# EAGLE schematic Multimeter (EAGLE 9.6.2)

## Sheet 1 of 3: ADC
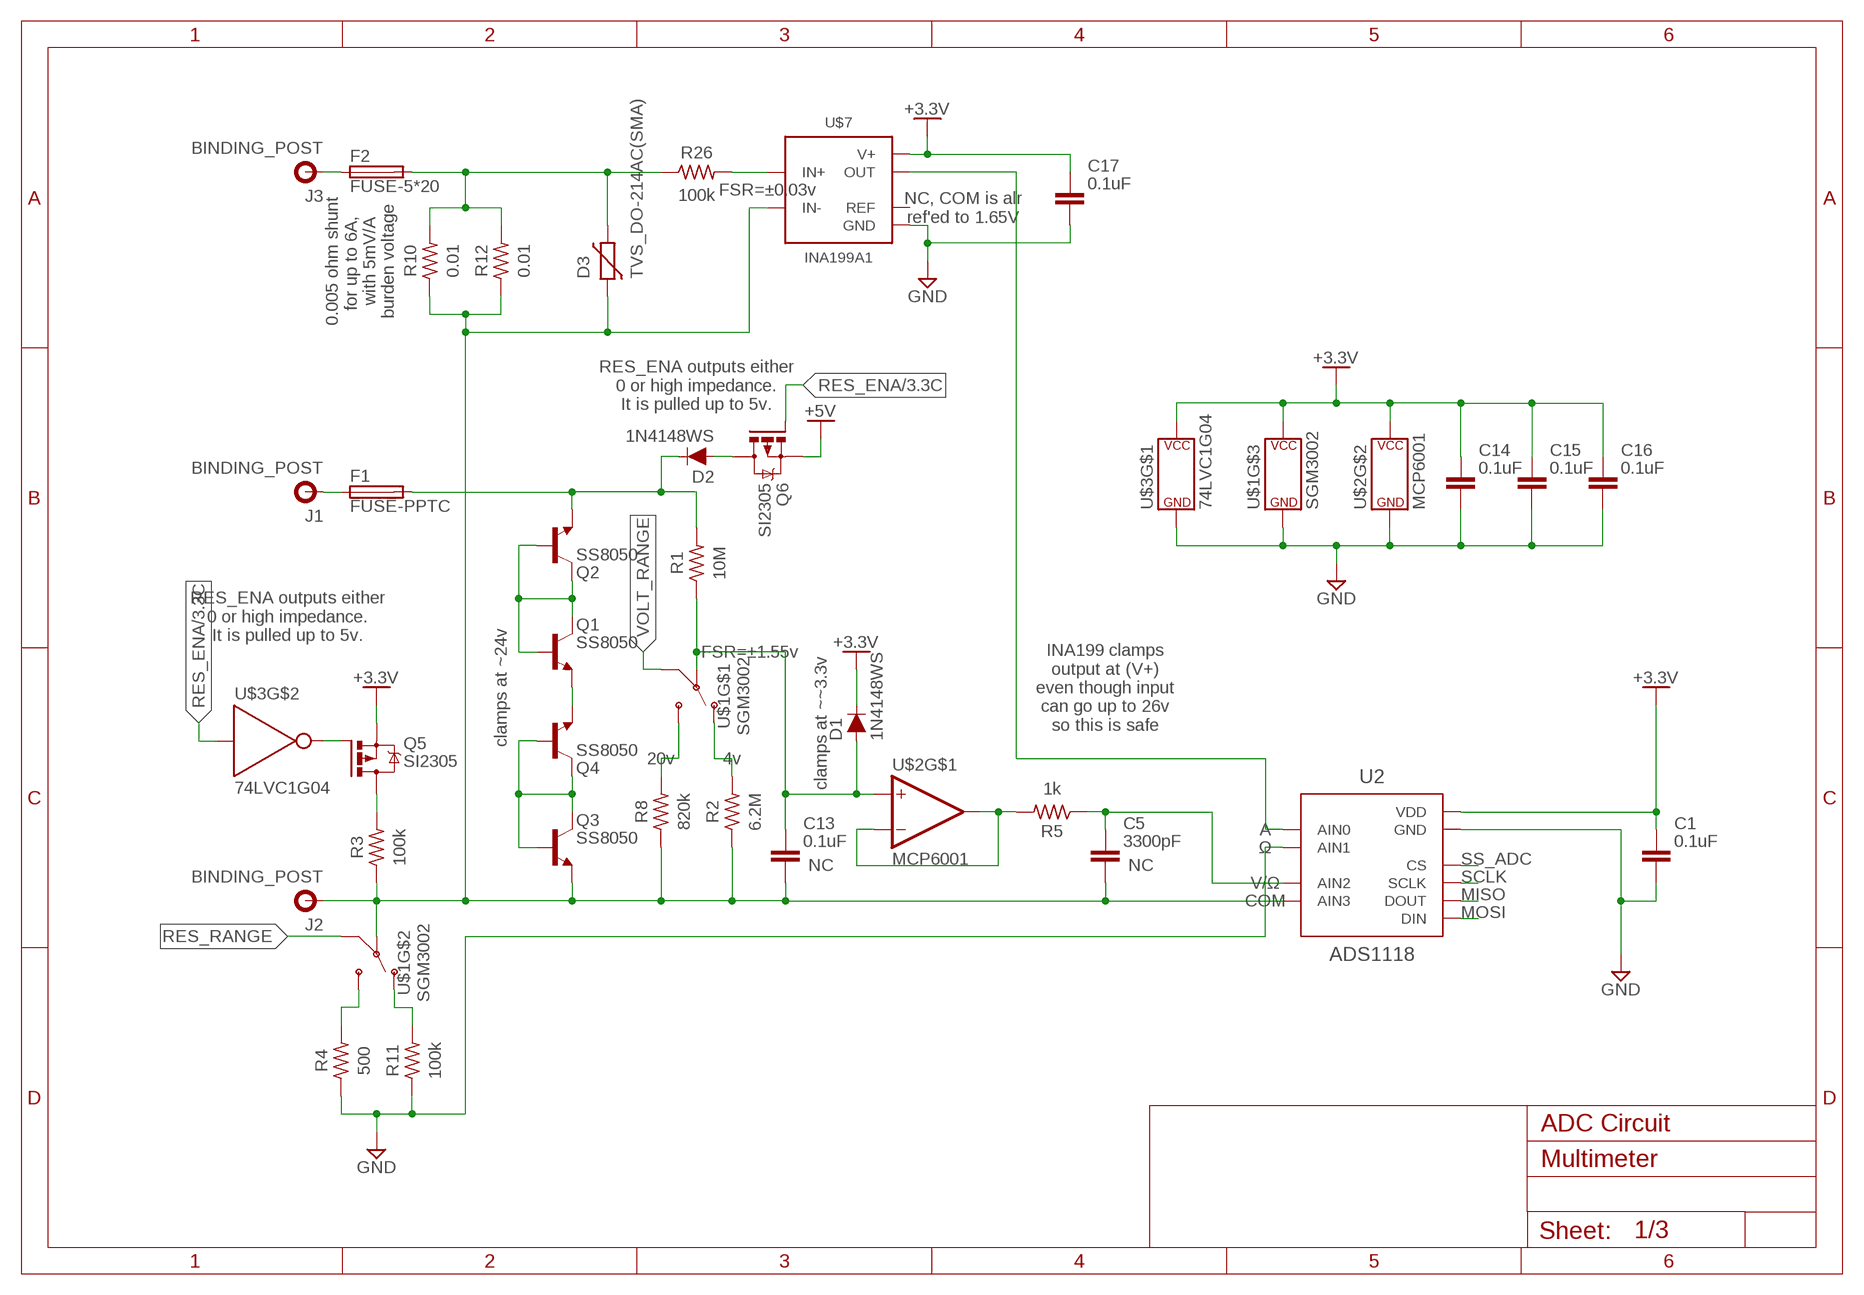
[diagram p0: schematic, sheet 1]

### Parts
C1  0.1uF  C_CHIP-0603(1608-METRIC)  [CAPC1608X85]
C5  3300pF  C_CHIP-0603(1608-METRIC)  [CAPC1608X85]
C13  0.1uF  C_CHIP-0603(1608-METRIC)  [CAPC1608X85]
C14  0.1uF  C_CHIP-0603(1608-METRIC)  [CAPC1608X85]
C15  0.1uF  C_CHIP-0603(1608-METRIC)  [CAPC1608X85]
C16  0.1uF  C_CHIP-0603(1608-METRIC)  [CAPC1608X85]
C17  0.1uF  C_CHIP-0603(1608-METRIC)  [CAPC1608X85]
D1  1N4148WS  DIODE  [SOD-323]
D2  1N4148WS  DIODE  [SOD-323]
D3  TVS_DO-214AC(SMA)  [DIOM5226X290N]
F1  FUSE-PPTC  [FUSE-PPTC-TH]
F2  FUSE-5*20  [FUSEHOLDER_"HD"]
J1  BINDING_POST  [BINDING_POST]
J2  BINDING_POST  [BINDING_POST]
J3  BINDING_POST  [BINDING_POST]
Q1  SS8050  NPN_SOT23  [SOT95P237X112-3N]
Q2  SS8050  NPN_SOT23  [SOT95P237X112-3N]
Q3  SS8050  NPN_SOT23  [SOT95P237X112-3N]
Q4  SS8050  NPN_SOT23  [SOT95P237X112-3N]
Q5  SI2305  PMOSFET_SOT23  [SOT23]
Q6  SI2305  PMOSFET_SOT23  [SOT23]
R1  10M  R-US_CHIP-0603(1608-METRIC)  [RESC1608X60]
R2  6.2M  R-US_CHIP-0603(1608-METRIC)  [RESC1608X60]
R3  100k  R-US_CHIP-0603(1608-METRIC)  [RESC1608X60]
R4  500  R-US_CHIP-0603(1608-METRIC)  [RESC1608X60]
R5  1k  R-US_CHIP-0603(1608-METRIC)  [RESC1608X60]
R8  820k  R-US_CHIP-0603(1608-METRIC)  [RESC1608X60]
R10  0.01  R-US_CHIP-2512(6332-METRIC)  [RESC6332X71]
R11  100k  R-US_CHIP-0603(1608-METRIC)  [RESC1608X60]
R12  0.01  R-US_CHIP-2512(6332-METRIC)  [RESC6332X71]
R26  100k  R-US_CHIP-0603(1608-METRIC)  [RESC1608X60]
U2  ADS1118  [VSSOP10]
U$1  SGM3002  [MSOP10]
U$2  MCP6001  [SOT23-5]
U$3  74LVC1G04  [SOT23-5]
U$7  INA199A1  INA199  [SC70-6]

### Nets
+3.3V: C1.1 C14.1 C15.1 C16.1 C17.1 D1.C Q5.2(S) U2.8(VDD) U$1.8(P$V+) U$2.5(P$V+) U$3.5(P$V+) U$7.3(V+) ; also sheet 2,3
+5V: Q6.2(S) ; also sheet 2,3
COM: C5.2 C13.2 D3.1 J2.P$1 Q3.1(E) R2.1 R3.1 R8.1 R10.1 R12.1 U2.7(AIN3) U$1.6(COM) U$7.5(IN-)
GND: C1.2 C14.2 C15.2 C16.2 C17.2 R4.1 R11.1 U2.3(GND) U2.5(AIN1) U$1.3(P$V-) U$2.2(P$V-) U$3.3(P$V-) U$7.2(GND) ; also sheet 2,3
MISO: U2.9(DOUT) ; also sheet 2
MOSI: U2.10(DIN) ; also sheet 2,3
N$1: D2.C F1.P$2 Q2.1(E) R1.2
N$3: C13.1 D1.A R1.1 U$1.10(COM) U$2.3(+IN)
N$4: D2.A Q6.3(D)
N$5: Q3.2(B) Q3.3(C) Q4.2(B) Q4.3(C)
N$6: F2.P$1 J3.P$1
N$8: R5.2 U$2.1(OUT) U$2.4(-IN)
N$11: C5.1 R5.1 U2.6(AIN2)
N$13: U2.4(AIN0) U$7.6(OUT)
N$14: R4.2 U$1.4(NO)
N$15: R8.2 U$1.2(NO)
N$16: R2.2 U$1.9(NC)
N$17: Q1.2(B) Q1.3(C) Q2.2(B) Q2.3(C)
N$18: Q1.1(E) Q4.1(E)
N$19: F1.P$1 J1.P$1
N$20: R11.2 U$1.7(NC)
N$21: D3.2 F2.P$2 R10.2 R12.2 R26.1
N$23: Q5.3(D) R3.2
N$25: Q5.1(G) U$3.4(Y)
N$38: R26.2 U$7.4(IN+)
RES_ENA: Q6.1(G) U$3.2(A) ; also sheet 2,3
RES_RANGE: U$1.5(IN) ; also sheet 2
SCLK: U2.1(SCLK) ; also sheet 2,3
SS_ADC: U2.2(CS) ; also sheet 2
VOLT_RANGE: U$1.1(IN) ; also sheet 2
Unconnected: U$7.1(REF)

### Notes on the sheet
- FSR=±0.03v
- NC, COM is alr
  ref'ed to 1.65V
- 0.005 ohm shunt
  for up to 6A, 
  with 5mV/A
  burden voltage
- RES_ENA outputs either
  0 or high impedance.
  It is pulled up to 5v.
- RES_ENA outputs either
  0 or high impedance.
  It is pulled up to 5v.
- FSR=±1.55v
- clamps at ~24v
- INA199 clamps
  output at (V+)
  even though input
  can go up to 26v
  so this is safe
- clamps at ~~3.3v
- 20v | 4v
- A
- Ω
- NC | NC
- V/Ω
- COM
- ADC Circuit

## Sheet 2 of 3: MCU & Power
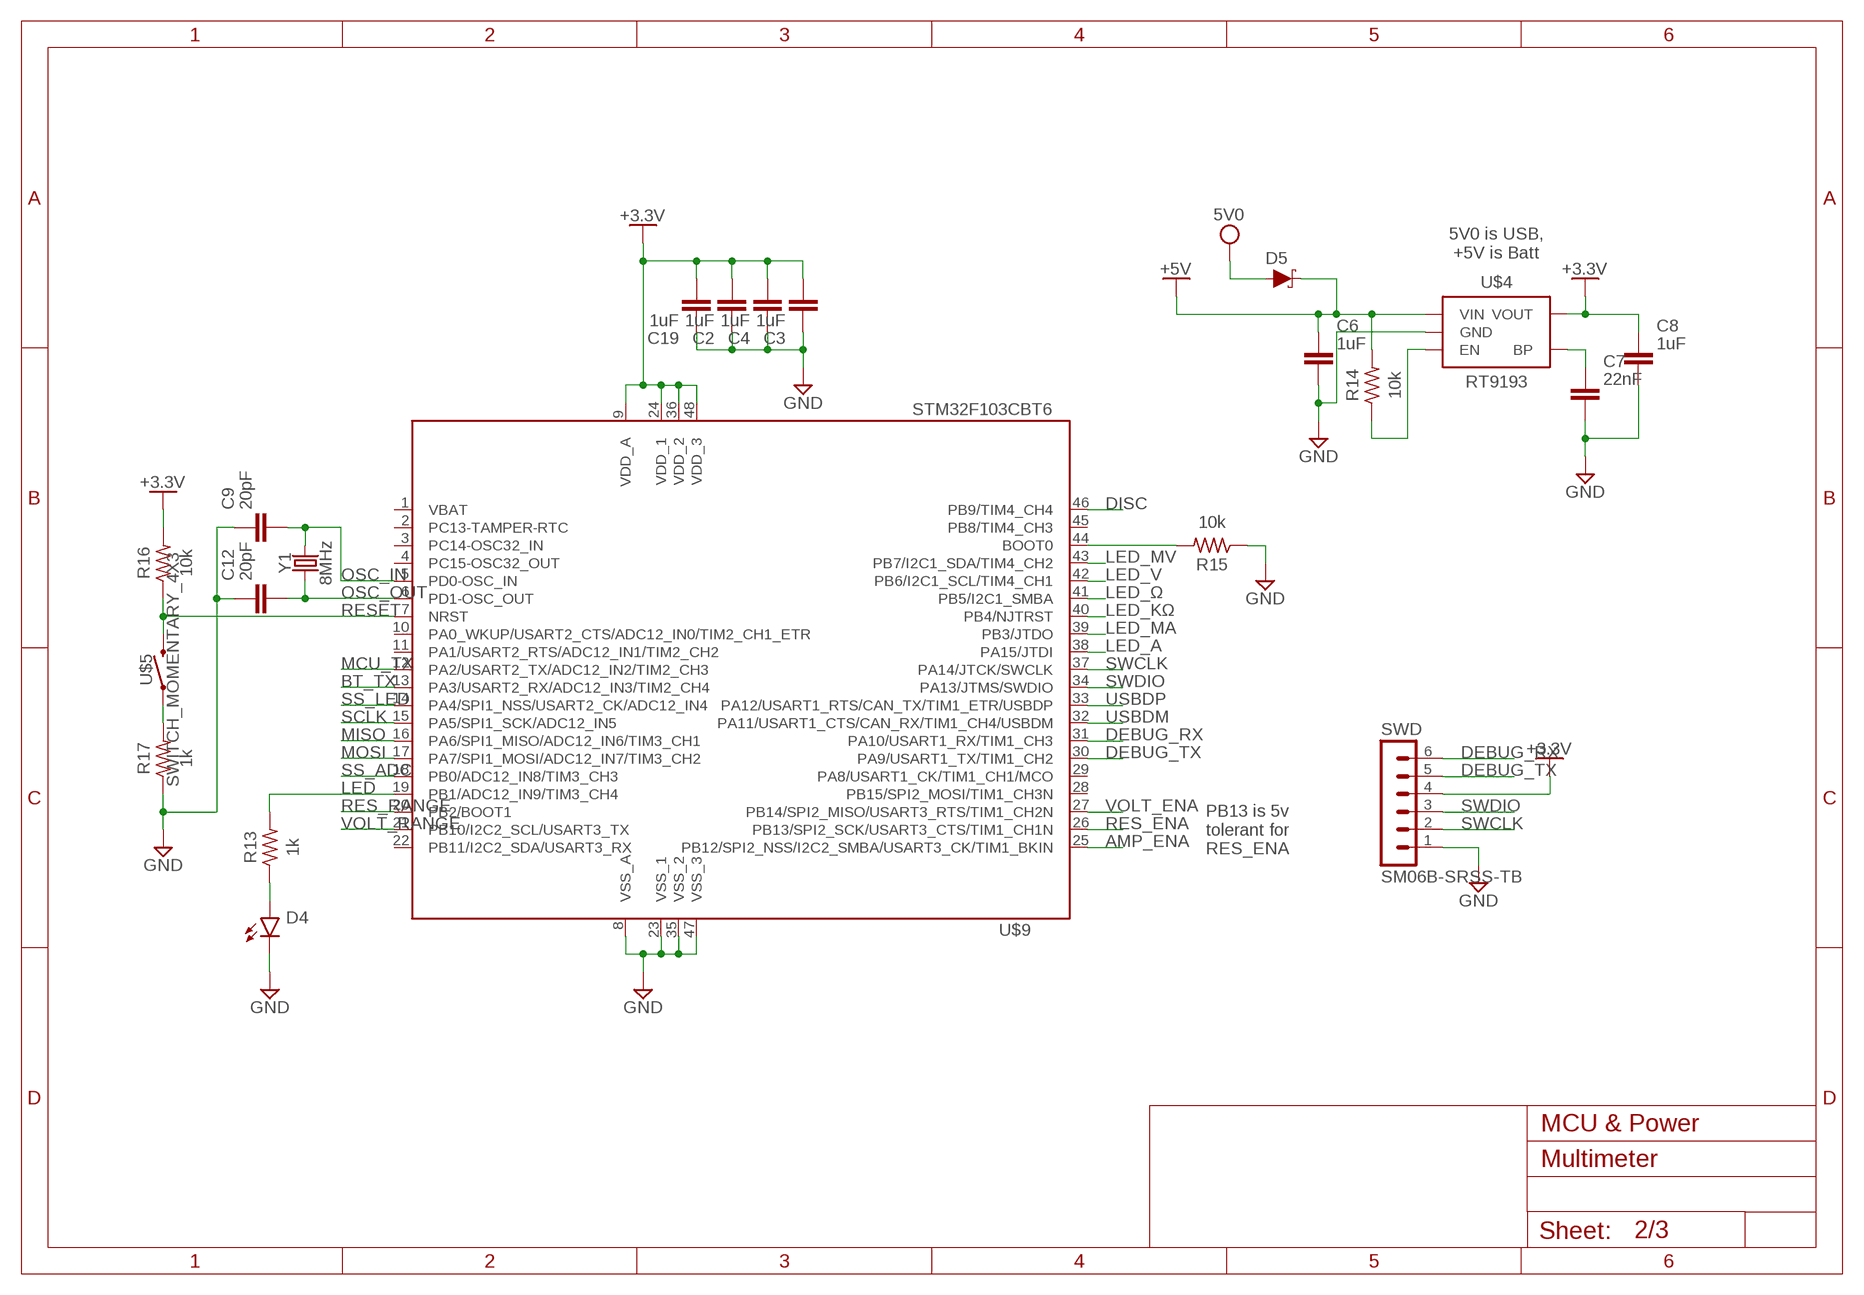
[diagram p1: schematic, sheet 2]

### Parts
C2  1uF  C_CHIP-0603(1608-METRIC)  [CAPC1608X85]
C3  1uF  C_CHIP-0603(1608-METRIC)  [CAPC1608X85]
C4  1uF  C_CHIP-0603(1608-METRIC)  [CAPC1608X85]
C6  1uF  C_CHIP-0603(1608-METRIC)  [CAPC1608X85]
C7  22nF  C_CHIP-0603(1608-METRIC)  [CAPC1608X85]
C8  1uF  C_CHIP-0603(1608-METRIC)  [CAPC1608X85]
C9  20pF  C_CHIP-0603(1608-METRIC)  [CAPC1608X85]
C12  20pF  C_CHIP-0603(1608-METRIC)  [CAPC1608X85]
C19  1uF  C_CHIP-0603(1608-METRIC)  [CAPC1608X85]
D4  LED_CHIP_BLUE-1608  [LEDC1608X39N_B]
D5  DIODE-SCHOTTKY  [SMA-DIODE]
R13  1k  R-US_CHIP-0603(1608-METRIC)  [RESC1608X60]
R14  10k  R-US_CHIP-0603(1608-METRIC)  [RESC1608X60]
R15  10k  R-US_CHIP-0603(1608-METRIC)  [RESC1608X60]
R16  10k  R-US_CHIP-0603(1608-METRIC)  [RESC1608X60]
R17  1k  R-US_CHIP-0603(1608-METRIC)  [RESC1608X60]
SWD  SM06B-SRSS-TB  [SM06B-SRSS-TB]
U$4  RT9193  [SOT23-5]
U$5  SWITCH_MOMENTARY_4X3  [MOMENTARY_SWITCH_4X3]
U$9  STM32F103CBT6  [LQFP48]
Y1  8MHz  CRYSTAL_5032  [CRYSTAL-SMD-5X3.2-2PAD]

### Nets
5V0: D5.A ; also sheet 3
+3.3V: C2.2 C3.2 C4.2 C8.1 C19.2 R16.2 SWD.4 U$4.5(VOUT) U$9.9(VDD_A) U$9.24(VDD_1) U$9.36(VDD_2) U$9.48(VDD_3) ; also sheet 1,3
+5V: C6.1 D5.C R14.2 U$4.1(VIN) ; also sheet 1,3
AMP_ENA: U$9.25(PB12/SPI2_NSS/I2C2_SMBA/USART3_CK/TIM1_BKIN) ; also sheet 3
BT_TX: U$9.13(PA3/USART2_RX/ADC12_IN3/TIM2_CH4) ; also sheet 3
DEBUG_RX: SWD.6 U$9.31(PA10/USART1_RX/TIM1_CH3)
DEBUG_TX: SWD.5 U$9.30(PA9/USART1_TX/TIM1_CH2)
DISC: U$9.46(PB9/TIM4_CH4) ; also sheet 3
GND: C2.1 C3.1 C4.1 C6.2 C7.2 C8.2 C9.1 C12.1 C19.1 D4.2(C) R15.1 R17.1 SWD.1 U$4.2(GND) U$9.8(VSS_A) U$9.23(VSS_1) U$9.35(VSS_2) U$9.47(VSS_3) ; also sheet 1,3
LED: R13.2 U$9.19(PB1/ADC12_IN9/TIM3_CH4)
LED_A: U$9.38(PA15/JTDI) ; also sheet 3
LED_KΩ: U$9.40(PB4/NJTRST) ; also sheet 3
LED_MA: U$9.39(PB3/JTDO) ; also sheet 3
LED_MV: U$9.43(PB7/I2C1_SDA/TIM4_CH2) ; also sheet 3
LED_V: U$9.42(PB6/I2C1_SCL/TIM4_CH1) ; also sheet 3
LED_Ω: U$9.41(PB5/I2C1_SMBA) ; also sheet 3
MCU_TX: U$9.12(PA2/USART2_TX/ADC12_IN2/TIM2_CH3) ; also sheet 3
MISO: U$9.16(PA6/SPI1_MISO/ADC12_IN6/TIM3_CH1) ; also sheet 1
MOSI: U$9.17(PA7/SPI1_MOSI/ADC12_IN7/TIM3_CH2) ; also sheet 1,3
N$7: D4.1(A) R13.1
N$9: R14.1 U$4.3(EN)
N$10: C7.1 U$4.4(BP)
N$12: R17.2 U$5.P$1
N$36: R15.2 U$9.44(BOOT0)
OSC_IN: C9.2 U$9.5(PD0-OSC_IN) Y1.P$2
OSC_OUT: C12.2 U$9.6(PD1-OSC_OUT) Y1.P$1
RES_ENA: U$9.26(PB13/SPI2_SCK/USART3_CTS/TIM1_CH1N) ; also sheet 1,3
RES_RANGE: U$9.20(PB2/BOOT1) ; also sheet 1
RESET: R16.1 U$5.P$2 U$9.7(NRST)
SCLK: U$9.15(PA5/SPI1_SCK/ADC12_IN5) ; also sheet 1,3
SS_ADC: U$9.18(PB0/ADC12_IN8/TIM3_CH3) ; also sheet 1
SS_LED: U$9.14(PA4/SPI1_NSS/USART2_CK/ADC12_IN4) ; also sheet 3
SWCLK: SWD.2 U$9.37(PA14/JTCK/SWCLK)
SWDIO: SWD.3 U$9.34(PA13/JTMS/SWDIO)
USBDM: U$9.32(PA11/USART1_CTS/CAN_RX/TIM1_CH4/USBDM) ; also sheet 3
USBDP: U$9.33(PA12/USART1_RTS/CAN_TX/TIM1_ETR/USBDP) ; also sheet 3
VOLT_ENA: U$9.27(PB14/SPI2_MISO/USART3_RTS/TIM1_CH2N) ; also sheet 3
VOLT_RANGE: U$9.21(PB10/I2C2_SCL/USART3_TX) ; also sheet 1
Unconnected: U$9.2(PC13-TAMPER-RTC) U$9.3(PC14-OSC32_IN) U$9.4(PC15-OSC32_OUT) U$9.10(PA0_WKUP/USART2_CTS/ADC12_IN0/TIM2_CH1_ETR) U$9.11(PA1/USART2_RTS/ADC12_IN1/TIM2_CH2) U$9.22(PB11/I2C2_SDA/USART3_RX) U$9.28(PB15/SPI2_MOSI/TIM1_CH3N) U$9.29(PA8/USART1_CK/TIM1_CH1/MCO) U$9.45(PB8/TIM4_CH3)

### Notes on the sheet
- 5V0 is USB,
  +5V is Batt
- PB13 is 5v
  tolerant for
  RES_ENA
- MCU & Power

## Sheet 3 of 3: Output & Selection
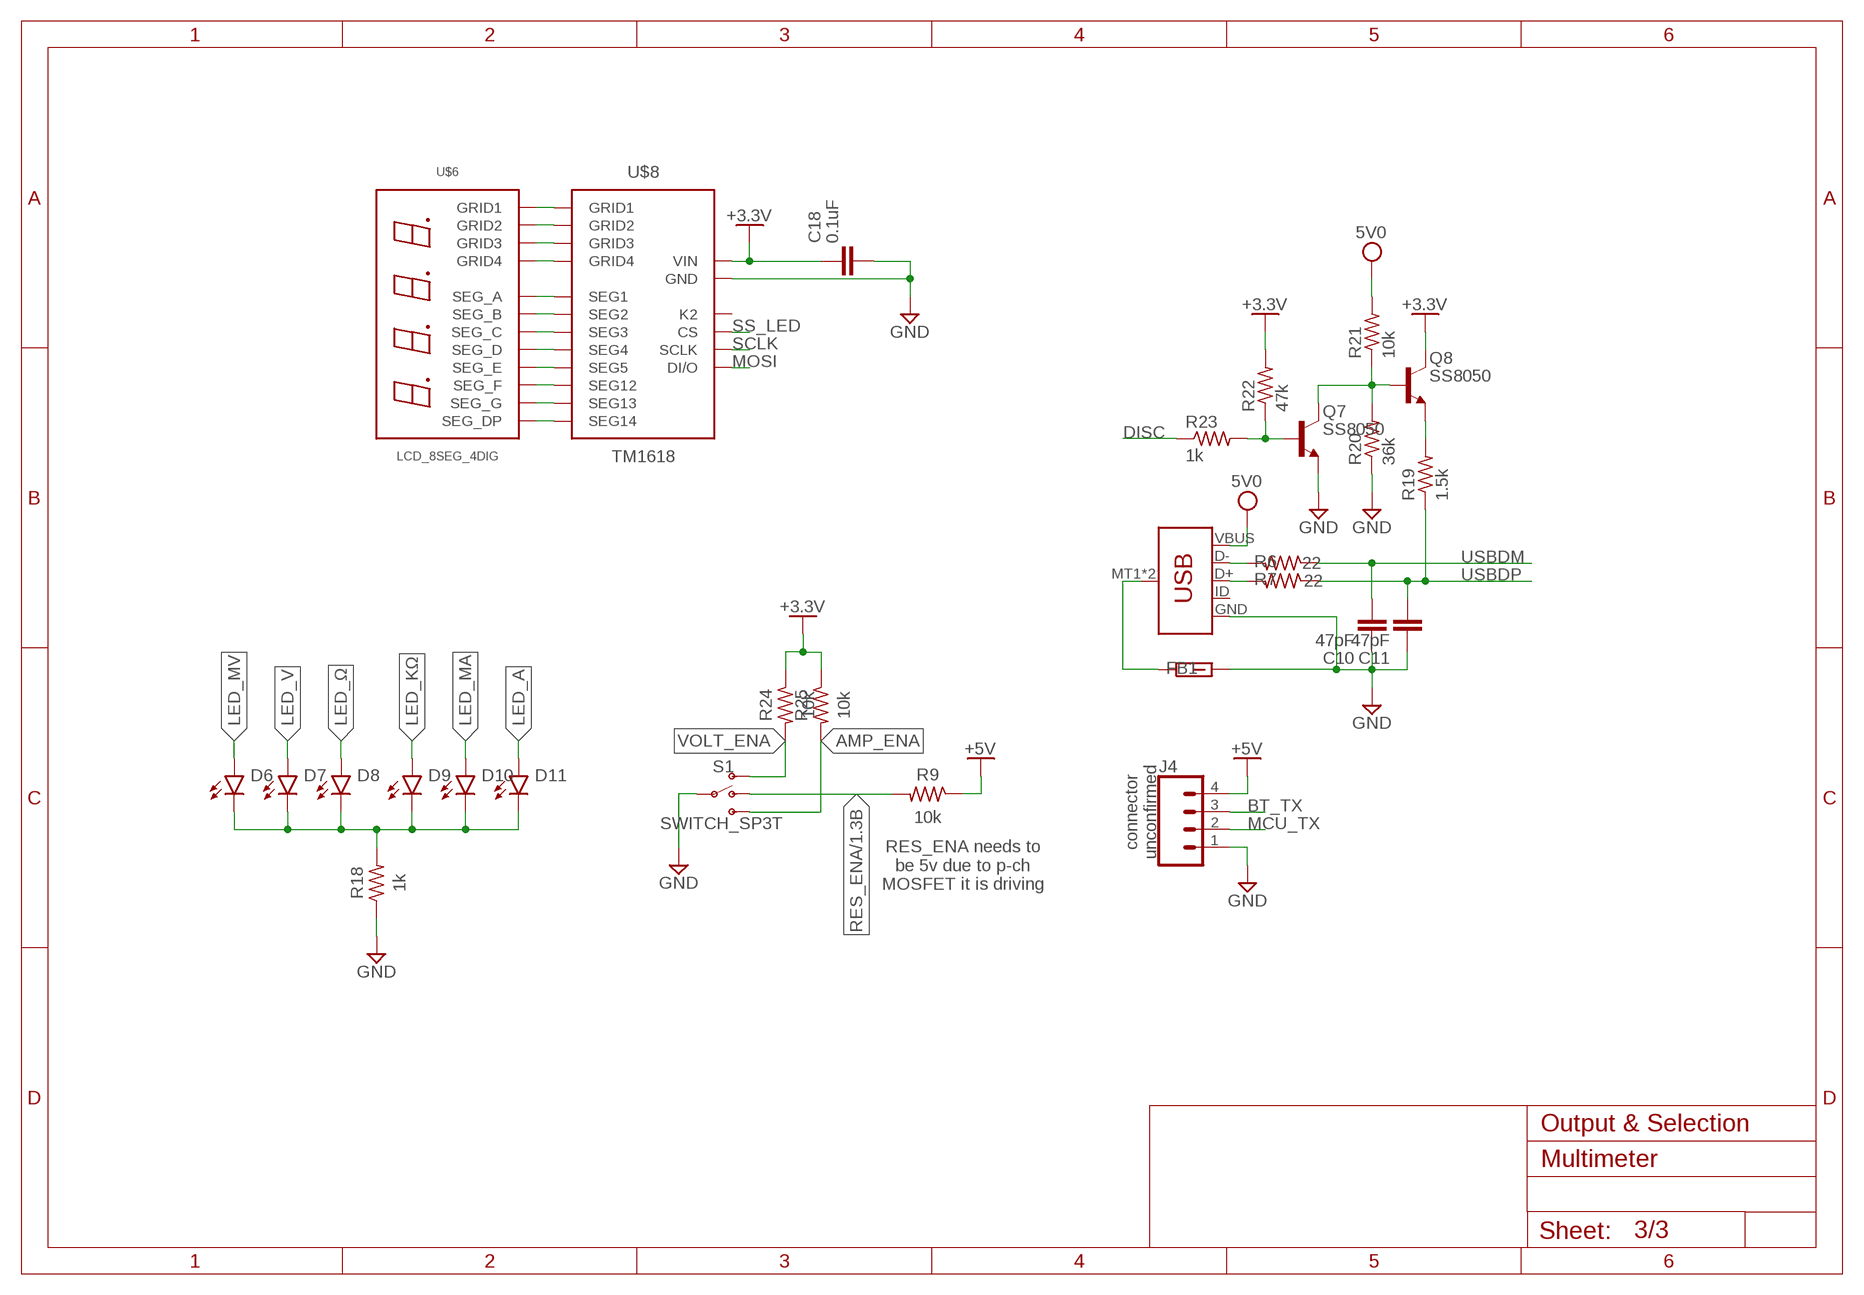
[diagram p2: schematic, sheet 3]

### Parts
C10  47pF  C_CHIP-0603(1608-METRIC)  [CAPC1608X85]
C11  47pF  C_CHIP-0603(1608-METRIC)  [CAPC1608X85]
C18  0.1uF  C_CHIP-0603(1608-METRIC)  [CAPC1608X85]
D6  LED_CHIP_BLUE-1608  [LEDC1608X39N_B]
D7  LED_CHIP_BLUE-1608  [LEDC1608X39N_B]
D8  LED_CHIP_BLUE-1608  [LEDC1608X39N_B]
D9  LED_CHIP_BLUE-1608  [LEDC1608X39N_B]
D10  LED_CHIP_BLUE-1608  [LEDC1608X39N_B]
D11  LED_CHIP_BLUE-1608  [LEDC1608X39N_B]
FB1  1k  FBCHIP-0603(1608-METRIC)  [BEADC1608X95N]
J4  CONN_04LOCK  [1X04_LOCK]
Q7  SS8050  NPN_SOT23  [SOT95P237X112-3N]
Q8  SS8050  NPN_SOT23  [SOT95P237X112-3N]
R6  22  R-US_CHIP-0603(1608-METRIC)  [RESC1608X60]
R7  22  R-US_CHIP-0603(1608-METRIC)  [RESC1608X60]
R9  10k  R-US_CHIP-0603(1608-METRIC)  [RESC1608X60]
R18  1k  R-US_CHIP-0603(1608-METRIC)  [RESC1608X60]
R19  1.5k  R-US_CHIP-0603(1608-METRIC)  [RESC1608X60]
R20  36k  R-US_CHIP-0603(1608-METRIC)  [RESC1608X60]
R21  10k  R-US_CHIP-0603(1608-METRIC)  [RESC1608X60]
R22  47k  R-US_CHIP-0603(1608-METRIC)  [RESC1608X60]
R23  1k  R-US_CHIP-0603(1608-METRIC)  [RESC1608X60]
R24  10k  R-US_CHIP-0603(1608-METRIC)  [RESC1608X60]
R25  10k  R-US_CHIP-0603(1608-METRIC)  [RESC1608X60]
S1  SWITCH_SP3T  [SWITCH_SP3T]
U$6  LCD_8SEG_4DIG  [LCD_8SEG_4DIG_0.4IN]
U$8  TM1618  [SOP-18]
X1  USB-MINIB  USB_MICRO-B  [USB-MICROB-CLEANED]

### Nets
5V0: R21.2 X1.VBUS ; also sheet 2
+3.3V: C18.1 Q8.3(C) R22.2 R24.1 R25.1 U$8.P5(VIN) ; also sheet 1,2
+5V: J4.4 R9.1 ; also sheet 1,2
AMP_ENA: R25.2 S1.4 ; also sheet 2
BT_TX: J4.3 ; also sheet 2
DISC: R23.1 ; also sheet 2
GND: C10.1 C11.1 C18.2 FB1.2 J4.1 Q7.1(E) R18.1 R20.1 S1.3 U$8.P16(GND) X1.GND ; also sheet 1,2
LED_A: D11.1(A) ; also sheet 2
LED_KΩ: D9.1(A) ; also sheet 2
LED_MA: D10.1(A) ; also sheet 2
LED_MV: D6.1(A) ; also sheet 2
LED_V: D7.1(A) ; also sheet 2
LED_Ω: D8.1(A) ; also sheet 2
MCU_TX: J4.2 ; also sheet 2
MOSI: U$8.P1(DI/O) ; also sheet 1,2
N$2: FB1.1 X1.MT1(SHIELD) X1.MT2(SHIELD)
N$22: U$6.11(SEG_A) U$8.P6(SEG1)
N$24: U$6.7(SEG_B) U$8.P7(SEG2)
N$26: U$6.4(SEG_C) U$8.P8(SEG3)
N$27: U$6.2(SEG_D) U$8.P9(SEG4)
N$28: U$6.1(SEG_E) U$8.P10(SEG5)
N$29: U$6.10(SEG_F) U$8.P11(SEG12)
N$30: U$6.5(SEG_G) U$8.P12(SEG13)
N$31: U$6.3(SEG_DP) U$8.P13(SEG14)
N$32: U$6.6(GRID4) U$8.P14(GRID4)
N$33: U$6.8(GRID3) U$8.P15(GRID3)
N$34: U$6.9(GRID2) U$8.P17(GRID2)
N$35: U$6.12(GRID1) U$8.P18(GRID1)
N$37: D6.2(C) D7.2(C) D8.2(C) D9.2(C) D10.2(C) D11.2(C) R18.2
N$51: Q8.1(E) R19.2
N$59: R6.2 X1.D-
N$60: R7.2 X1.D+
N$71: Q7.3(C) Q8.2(B) R20.2 R21.1
N$73: Q7.2(B) R22.1 R23.2
RES_ENA: R9.2 S1.2 ; also sheet 1,2
SCLK: U$8.P2(SCLK) ; also sheet 1,2
SS_LED: U$8.P3(CS) ; also sheet 2
USBDM: C10.2 R6.1 ; also sheet 2
USBDP: C11.2 R7.1 R19.1 ; also sheet 2
VOLT_ENA: R24.2 S1.1 ; also sheet 2
Unconnected: U$8.P4(K2) X1.ID

### Notes on the sheet
- connector
  unconfirmed
- RES_ENA needs to
  be 5v due to p-ch
  MOSFET it is driving
- Output & Selection

## Power pins joined to a net without a drawn wire
VBAT: U$9.1(VBAT)

## Library data of the parts
C1-C19 = Capacitor:C: Capacitor - Generic; CATEGORY: Capacitor
D1 D2 = JH:DIODE
D3 = Circuit-Protection:TVS: TVS Diode - Generic; CATEGORY: Circuit-Protection; SUB-CATEGORY: TVS-Diode
D4 D6-D11 = Opto-Electronic:LED_CHIP: LED - Generic; CATEGORY: Opto-Electronic; COLOR: Blue; SUB-CATEGORY: LED
D5 = JH:DIODE-SCHOTTKY
F1 F2 = JH:FUSE
FB1 = Filter:FB: Ferrite Bead - Generic; CATEGORY: Filter; SUB-CATEGORY: Ferrite bead
J1-J3 = Connectors:BINDING_POST: Binding Post The component itself has an threaded, insulated body that goes through the board, with a small threaded metal stud coming off the back. The intent of this package is that the post goes through a milled obling hole, and a small wire would be used to connect from the PCB pad to the metal contact on the post. SparkFun Products: SparkFun Decade Resistance Box <https://www.sparkfun.com/products/13006> SparkFun Benchtop Power Board Kit <https://www.sparkfun.com/products/12867> Binding Post - Red <https://www.sparkfun.com/products/9739> Binding Post - Black <https://www.sparkfun.com/products/9740>; PROD_ID: CONN-09675; SF_ID: PRT-09740
J4 = Connectors:CONN_04: Multi connection point. Often used as Generic Header-pin footprint for 0.1 inch spaced/style header connections On any of the 0.1 inch spaced packages, you can populate with these: Break Away Headers - Straight <https://www.sparkfun.com/products/116> (PRT-00116) Break Away Male Headers - Right Angle <https://www.sparkfun.com/products/553> (PRT-00553) Female Headers <https://www.sparkfun.com/products/115> (PRT-00115) Break Away Headers - Machine Pin <https://www.sparkfun.com/products/117> (PRT-00117) Break Away Female Headers - Swiss Machine Pin <https://www.sparkfun.com/products/743> (PRT-00743) For SCREWTERMINALS and SPRING TERMINALS visit here: Screw Terimnals on SparkFun.com <https://www.sparkfun.com/search/results?term=Screw+Terminals> (5mm/3.5mm/2.54mm spacing) This device is also useful as a general connection point to wire up your design to another part of your project. Our various solder wires solder well into these plated through hole pads. Hook-Up Wire - Assortment (Stranded, 22 AWG) <https://www.sparkfun.com/products/11375> (PRT-11375) Hook-Up Wire - Assortment (Solid Core, 22 AWG) <https://www.sparkfun.com/products/11367> (PRT-11367) View the entire wire category on our website here <https://www.sparkfun.com/categories/141> Special notes: Molex polarized connector foot print use with SKU : PRT-08231 with associated crimp pins and housings. 1MM SMD Version SKU: PRT-10208; PROD_ID: CONN-09696
Q1-Q4 Q7 Q8 = Transistor:NPN: NPN - Generic; CATEGORY: Transistor; SUB-CATEGORY: BJT; TYPE: NPN
Q5 Q6 = Transistor:PMOSFET: P-Channel MOSFET - Generic; CATEGORY: Transistor; SUB-CATEGORY: MOSFET; TYPE: P-Channel
R1-R26 = Resistor:R-US: Resistor Fixed - ANSI; CATEGORY: Resistor; SUB-CATEGORY: Fixed
S1 = JH:SWITCH_SP3T
SWD = con-JST SH:SM06B-SRSS: JST SH series header 1.00mm pitch disconnectable crimp style connectors, horizontal (side entry type), 6 pins
U2 = JH:ADS1118; MANUFACTURER: Texas Instruments; PARTNUMBER: ADS1118IDGSR; REFDES: RefDes; TYPE: TYPE; VALUE: Value
U$1 = JH:SGM3002
U$2 = JH:MCP6001
U$3 = JH:74LVC1G04
U$4 = JH:RT9193
U$5 = JH:SWITCH_MOMENTARY
U$6 = JH:LCD_8SEG_4DIG
U$7 = JH:INA199
U$8 = JH:TM1618
U$9 = JH:STM32F103CBT6
X1 = Connectors:USB_MICRO-B: USB Type Micro-B Connector Male/female and PTH/SMT variants SparkFun Products: SparkFun microB USB Breakout <https://www.sparkfun.com/products/12035> SparkFun USB microB Plug Breakout <https://www.sparkfun.com/products/10031> SparkFun ESP8266 Thing <https://www.sparkfun.com/products/13231>
Y1 = JH:CRYSTAL: Crystals (Generic) These are passive quartz crystals, which can be used as a clock source for a microcontroller. Crystal's are two-terminal devices. They require external "load" capacitors to generate an oscillating signal.